# Altium project Board-PCB.PrjPcb
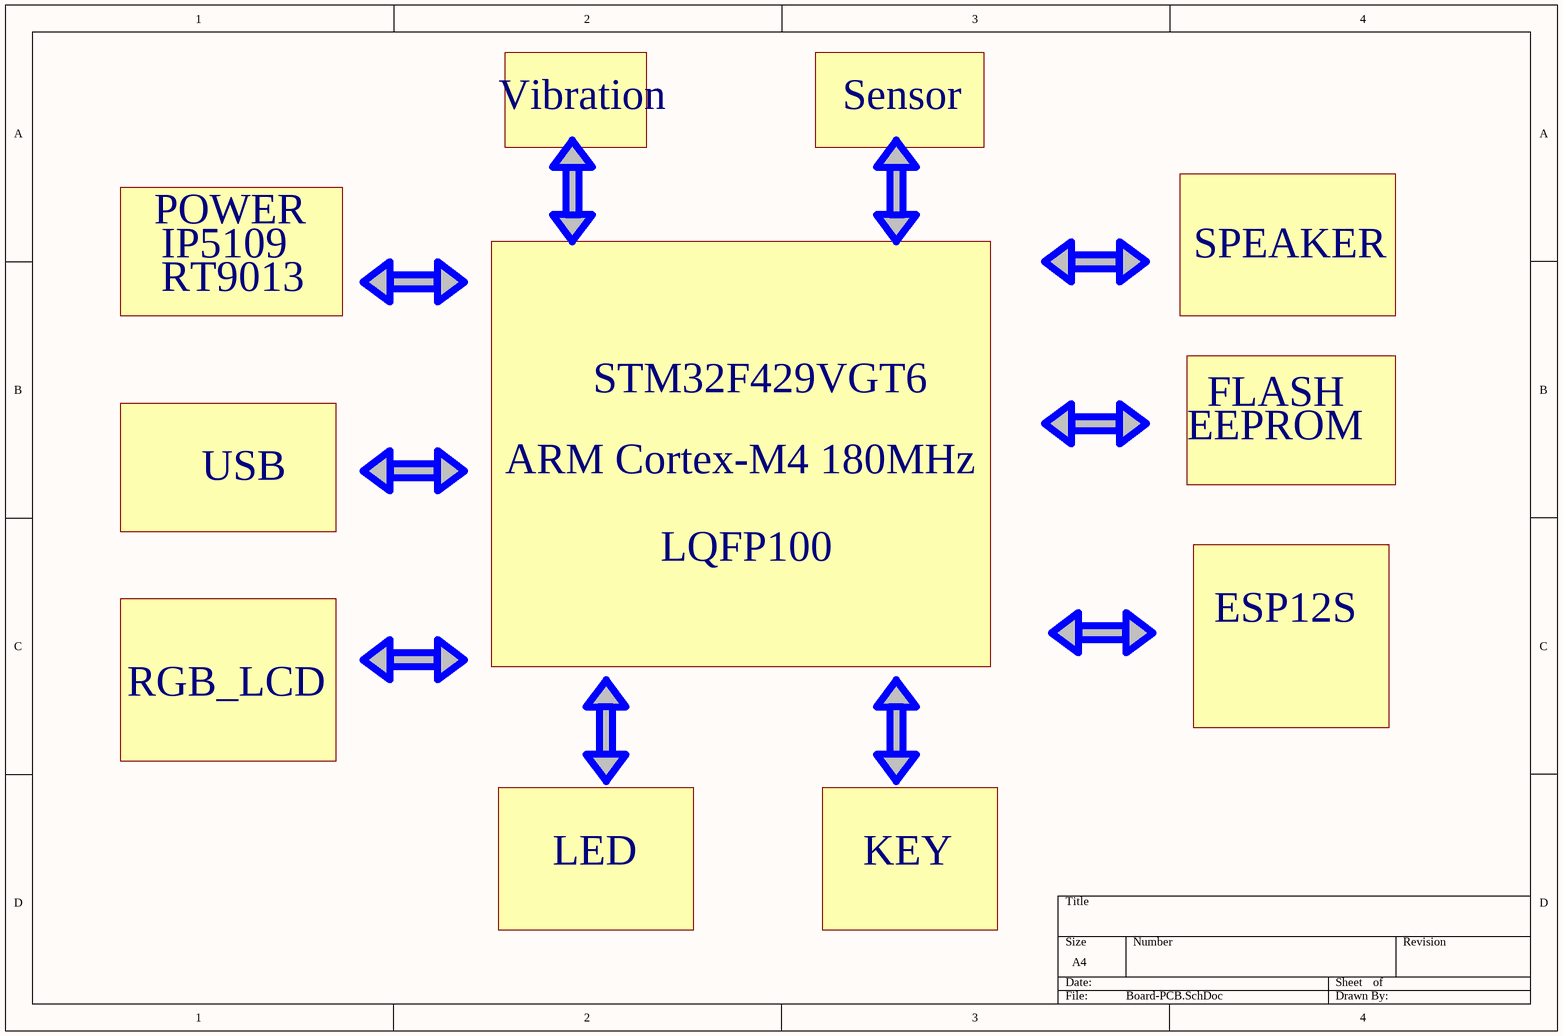
[diagram p0: Board-PCB.SchDoc]
10 sheets, 166 parts. Net scope: global (net labels, ports and power ports of the same name join across sheets).
Board files: Board-PCB.PcbDoc, PCB-Panel.PcbDoc
Sheets:
  Board-PCB.SchDoc
  MCU.SchDoc
  POWER.SchDoc
  USB.SchDoc
  memory.SchDoc
  LCD.SchDoc
  wireless.SchDoc
  sensor.SchDoc
  connect.SchDoc
  speaker.SchDoc

## Sheet Board-PCB.SchDoc: Bison-Board
size A4; DrawnBy: mzy2364; Revision: V1.4

### Notes on the sheet
- Vibration
- Sensor
- POWER
- IP5109
- RT9013
- SPEAKER
- STM32F429VGT6
- EEPROM
- FLASH
- USB
- ARM Cortex-M4 180MHz
- LQFP100
- ESP12S
- RGB_LCD
- LED
- KEY

## Sheet MCU.SchDoc: Bison-Board
size A2; DrawnBy: mzy2364; Revision: V1.4
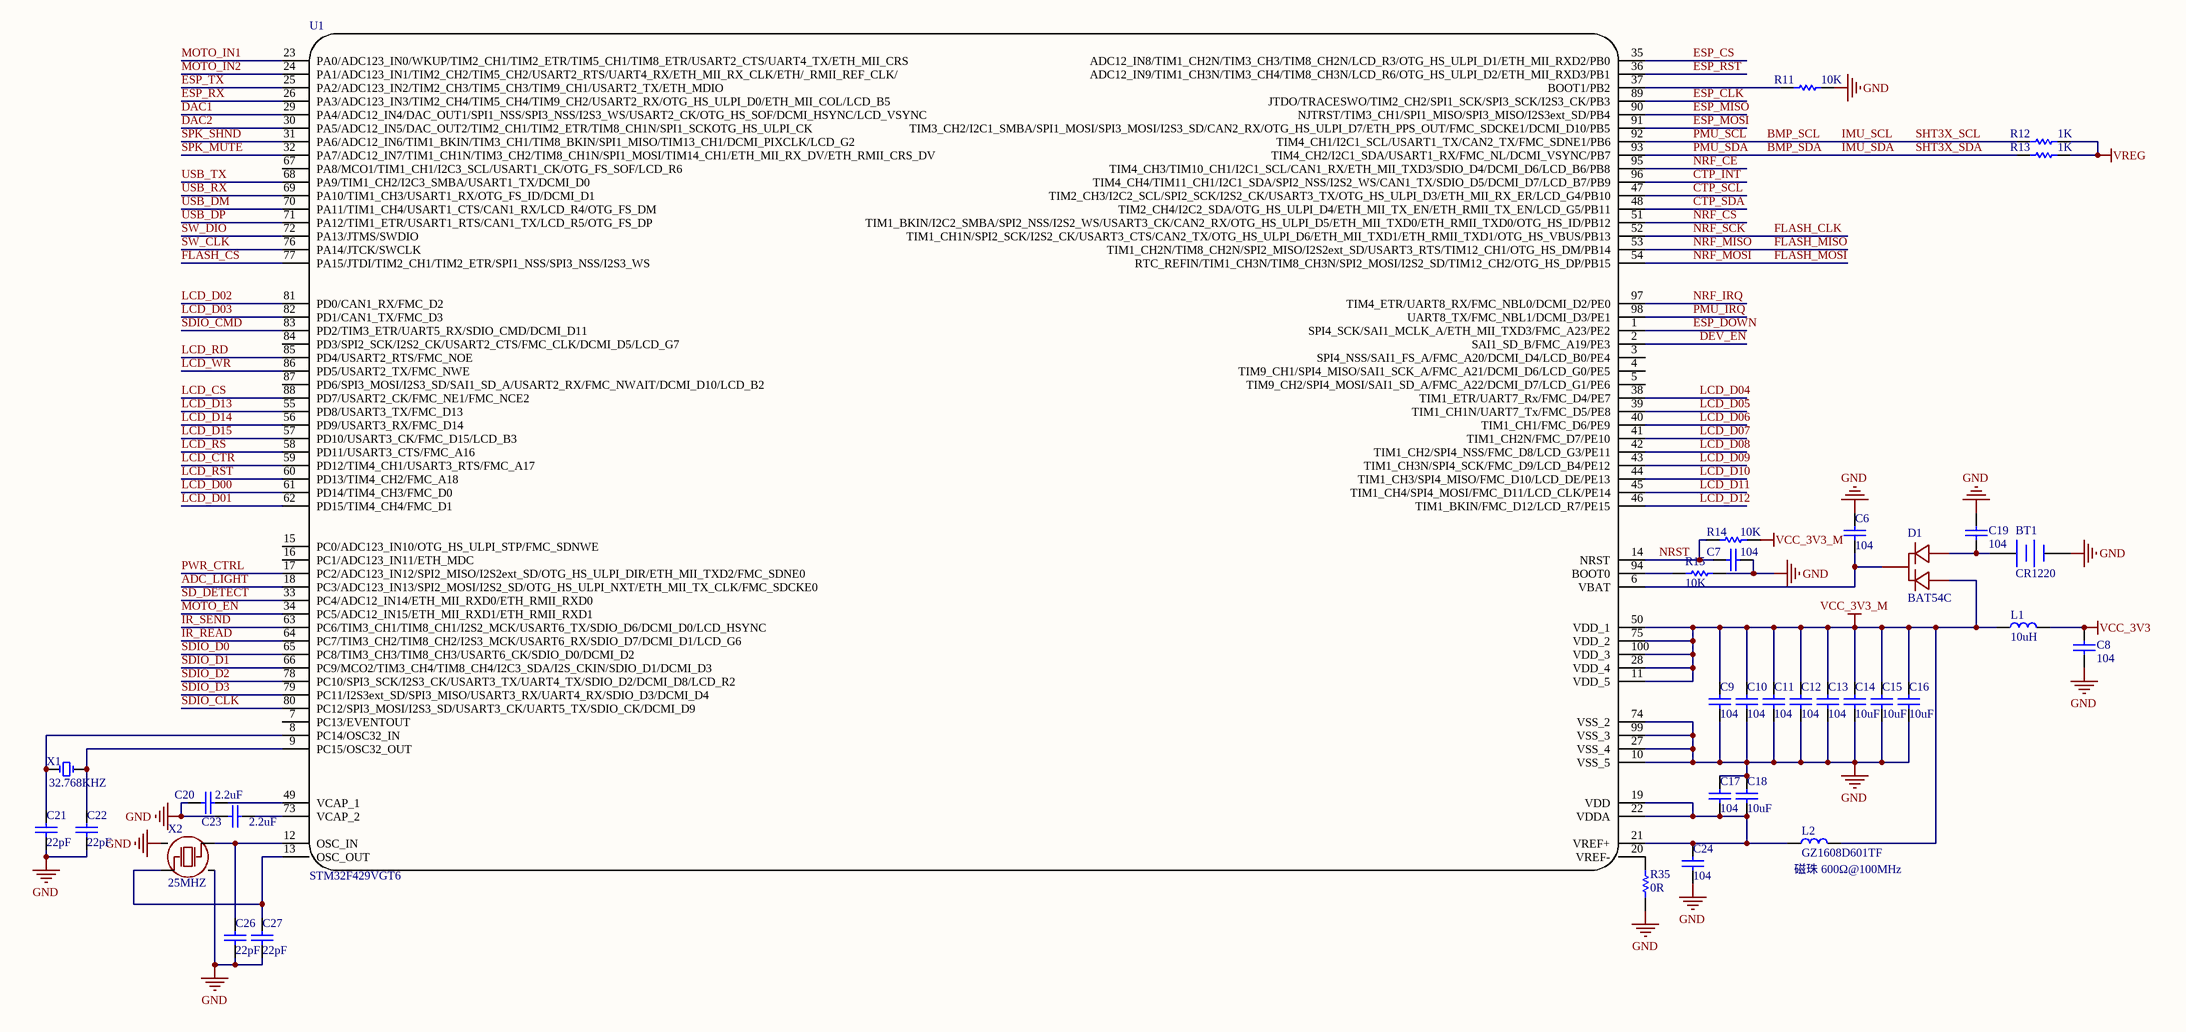
[diagram p1: MCU.SchDoc]

### Parts
BT1  CR1220  [CR1220-2]
C6  104  [C 0603]
C7  104  [C 0603]
C8  104  [C 0603]
C9  104  [C 0603]
C10  104  [C 0603]
C11  104  [C 0603]
C12  104  [C 0603]
C13  104  [C 0603]
C14  10uF  [C 0603]
C15  10uF  [C 0603]
C16  10uF  [C 0603]
C17  104  [C 0603]
C18  10uF  [C 0603]
C19  104  [C 0603]
C20  2.2uF  [C 0603]
C21  22pF  [C 0603]
C22  22pF  [C 0603]
C23  2.2uF  [C 0603]
C24  104  [C 0603]
C26  22pF  [C 0603]
C27  22pF  [C 0603]
D1  BAT54C  [SOT-23]
L1  10uH  [L 0603]
L2  GZ1608D601TF  [L 0603]
R11  10K  [R 0603]
R12  1K  [R 0603]
R13  1K  [R 0603]
R14  10K  [R 0603]
R15  10K  [R 0603]
R35  0R  [R 0603]
U1  STM32F429VGT6  [LQFP100]
X1  32.768KHZ  [XTAL-3215]
X2  25MHZ  [SMD-3225]

### Nets
GND: BT1.2(-) C6.2 C7.1 C8.1 C9.1 C10.1 C11.1 C12.1 C13.1 C14.1 C15.1 C16.1 C17.2 C18.2 C19.1 C20.1 C21.1 C22.1 C23.1 C24.1 C26.1 C27.1 R11.2 R15.2 R35.1 U1.10(VSS_5) U1.27(VSS_4) U1.74(VSS_2) U1.99(VSS_3) X2.2 X2.4
VCC_3V3: C8.2 L1.2
VCC_3V3_M: C9.2 C10.2 C11.2 C12.2 C13.2 C14.2 C15.2 C16.2 D1.1(A) L1.1 L2.2 R14.1 U1.11(VDD_5) U1.28(VDD_4) U1.50(VDD_1) U1.75(VDD_2) U1.100(VDD_3)
VREG: R12.2 R13.2
ADC_LIGHT: U1.18(PC3/ADC123_IN13/SPI2_MOSI/I2S2_SD/OTG_HS_ULPI_NXT/ETH_MII_TX_CLK/FMC_SDCKE0)
BMP_SCL: R12.1 U1.92(TIM4_CH1/I2C1_SCL/USART1_TX/CAN2_TX/FMC_SDNE1/PB6)  [also labelled IMU_SCL, PMU_SCL, SHT3X_SCL]
BMP_SDA: R13.1 U1.93(TIM4_CH2/I2C1_SDA/USART1_RX/FMC_NL/DCMI_VSYNC/PB7)  [also labelled IMU_SDA, PMU_SDA, SHT3X_SDA]
CTP_INT: U1.96(TIM4_CH4/TIM11_CH1/I2C1_SDA/SPI2_NSS/I2S2_WS/CAN1_TX/SDIO_D5/DCMI_D7/LCD_B7/PB9)
CTP_SCL: U1.47(TIM2_CH3/I2C2_SCL/SPI2_SCK/I2S2_CK/USART3_TX/OTG_HS_ULPI_D3/ETH_MII_RX_ER/LCD_G4/PB10)
CTP_SDA: U1.48(TIM2_CH4/I2C2_SDA/OTG_HS_ULPI_D4/ETH_MII_TX_EN/ETH_RMII_TX_EN/LCD_G5/PB11)
DAC1: U1.29(PA4/ADC12_IN4/DAC_OUT1/SPI1_NSS/SPI3_NSS/I2S3_WS/USART2_CK/OTG_HS_SOF/DCMI_HSYNC/LCD_VSYNC)
DAC2: U1.30(PA5/ADC12_IN5/DAC_OUT2/TIM2_CH1/TIM2_ETR/TIM8_CH1N/SPI1_SCKOTG_HS_ULPI_CK)
DEV_EN: U1.2(SAI1_SD_B/FMC_A19/PE3)
ESP_CLK: U1.89(JTDO/TRACESWO/TIM2_CH2/SPI1_SCK/SPI3_SCK/I2S3_CK/PB3)
ESP_CS: U1.35(ADC12_IN8/TIM1_CH2N/TIM3_CH3/TIM8_CH2N/LCD_R3/OTG_HS_ULPI_D1/ETH_MII_RXD2/PB0)
ESP_DOWN: U1.1(SPI4_SCK/SAI1_MCLK_A/ETH_MII_TXD3/FMC_A23/PE2)
ESP_MISO: U1.90(NJTRST/TIM3_CH1/SPI1_MISO/SPI3_MISO/I2S3ext_SD/PB4)
ESP_MOSI: U1.91(TIM3_CH2/I2C1_SMBA/SPI1_MOSI/SPI3_MOSI/I2S3_SD/CAN2_RX/OTG_HS_ULPI_D7/ETH_PPS_OUT/FMC_SDCKE1/DCMI_D10/PB5)
ESP_RST: U1.36(ADC12_IN9/TIM1_CH3N/TIM3_CH4/TIM8_CH3N/LCD_R6/OTG_HS_ULPI_D2/ETH_MII_RXD3/PB1)
ESP_RX: U1.26(PA3/ADC123_IN3/TIM2_CH4/TIM5_CH4/TIM9_CH2/USART2_RX/OTG_HS_ULPI_D0/ETH_MII_COL/LCD_B5)
ESP_TX: U1.25(PA2/ADC123_IN2/TIM2_CH3/TIM5_CH3/TIM9_CH1/USART2_TX/ETH_MDIO)
FLASH_CLK: U1.52(TIM1_CH1N/SPI2_SCK/I2S2_CK/USART3_CTS/CAN2_TX/OTG_HS_ULPI_D6/ETH_MII_TXD1/ETH_RMII_TXD1/OTG_HS_VBUS/PB13)  [also labelled NRF_SCK]
FLASH_CS: U1.77(PA15/JTDI/TIM2_CH1/TIM2_ETR/SPI1_NSS/SPI3_NSS/I2S3_WS)
FLASH_MISO: U1.53(TIM1_CH2N/TIM8_CH2N/SPI2_MISO/I2S2ext_SD/USART3_RTS/TIM12_CH1/OTG_HS_DM/PB14)  [also labelled NRF_MISO]
FLASH_MOSI: U1.54(RTC_REFIN/TIM1_CH3N/TIM8_CH3N/SPI2_MOSI/I2S2_SD/TIM12_CH2/OTG_HS_DP/PB15)  [also labelled NRF_MOSI]
IR_READ: U1.64(PC7/TIM3_CH2/TIM8_CH2/I2S3_MCK/USART6_RX/SDIO_D7/DCMI_D1/LCD_G6)
IR_SEND: U1.63(PC6/TIM3_CH1/TIM8_CH1/I2S2_MCK/USART6_TX/SDIO_D6/DCMI_D0/LCD_HSYNC)
LCD_CS: U1.88(PD7/USART2_CK/FMC_NE1/FMC_NCE2)
LCD_CTR: U1.59(PD12/TIM4_CH1/USART3_RTS/FMC_A17)
LCD_D00: U1.61(PD14/TIM4_CH3/FMC_D0)
LCD_D01: U1.62(PD15/TIM4_CH4/FMC_D1)
LCD_D02: U1.81(PD0/CAN1_RX/FMC_D2)
LCD_D03: U1.82(PD1/CAN1_TX/FMC_D3)
LCD_D04: U1.38(TIM1_ETR/UART7_Rx/FMC_D4/PE7)
LCD_D05: U1.39(TIM1_CH1N/UART7_Tx/FMC_D5/PE8)
LCD_D06: U1.40(TIM1_CH1/FMC_D6/PE9)
LCD_D07: U1.41(TIM1_CH2N/FMC_D7/PE10)
LCD_D08: U1.42(TIM1_CH2/SPI4_NSS/FMC_D8/LCD_G3/PE11)
LCD_D09: U1.43(TIM1_CH3N/SPI4_SCK/FMC_D9/LCD_B4/PE12)
LCD_D10: U1.44(TIM1_CH3/SPI4_MISO/FMC_D10/LCD_DE/PE13)
LCD_D11: U1.45(TIM1_CH4/SPI4_MOSI/FMC_D11/LCD_CLK/PE14)
LCD_D12: U1.46(TIM1_BKIN/FMC_D12/LCD_R7/PE15)
LCD_D13: U1.55(PD8/USART3_TX/FMC_D13)
LCD_D14: U1.56(PD9/USART3_RX/FMC_D14)
LCD_D15: U1.57(PD10/USART3_CK/FMC_D15/LCD_B3)
LCD_RD: U1.85(PD4/USART2_RTS/FMC_NOE)
LCD_RS: U1.58(PD11/USART3_CTS/FMC_A16)
LCD_RST: U1.60(PD13/TIM4_CH2/FMC_A18)
LCD_WR: U1.86(PD5/USART2_TX/FMC_NWE)
MOTO_EN: U1.34(PC5/ADC12_IN15/ETH_MII_RXD1/ETH_RMII_RXD1)
MOTO_IN1: U1.23(PA0/ADC123_IN0/WKUP/TIM2_CH1/TIM2_ETR/TIM5_CH1/TIM8_ETR/USART2_CTS/UART4_TX/ETH_MII_CRS)
MOTO_IN2: U1.24(PA1/ADC123_IN1/TIM2_CH2/TIM5_CH2/USART2_RTS/UART4_RX/ETH_MII_RX_CLK/ETH/_RMII_REF_CLK/)
NRF_CE: U1.95(TIM4_CH3/TIM10_CH1/I2C1_SCL/CAN1_RX/ETH_MII_TXD3/SDIO_D4/DCMI_D6/LCD_B6/PB8)
NRF_CS: U1.51(TIM1_BKIN/I2C2_SMBA/SPI2_NSS/I2S2_WS/USART3_CK/CAN2_RX/OTG_HS_ULPI_D5/ETH_MII_TXD0/ETH_RMII_TXD0/OTG_HS_ID/PB12)
NRF_IRQ: U1.97(TIM4_ETR/UART8_RX/FMC_NBL0/DCMI_D2/PE0)
NRST: C7.2 R14.2 U1.14(NRST)
PMU_IRQ: U1.98(UART8_TX/FMC_NBL1/DCMI_D3/PE1)
PWR_CTRL: U1.17(PC2/ADC123_IN12/SPI2_MISO/I2S2ext_SD/OTG_HS_ULPI_DIR/ETH_MII_TXD2/FMC_SDNE0)
SD_DETECT: U1.33(PC4/ADC12_IN14/ETH_MII_RXD0/ETH_RMII_RXD0)
SDIO_CLK: U1.80(PC12/SPI3_MOSI/I2S3_SD/USART3_CK/UART5_TX/SDIO_CK/DCMI_D9)
SDIO_CMD: U1.83(PD2/TIM3_ETR/UART5_RX/SDIO_CMD/DCMI_D11)
SDIO_D0: U1.65(PC8/TIM3_CH3/TIM8_CH3/USART6_CK/SDIO_D0/DCMI_D2)
SDIO_D1: U1.66(PC9/MCO2/TIM3_CH4/TIM8_CH4/I2C3_SDA/I2S_CKIN/SDIO_D1/DCMI_D3)
SDIO_D2: U1.78(PC10/SPI3_SCK/I2S3_CK/USART3_TX/UART4_TX/SDIO_D2/DCMI_D8/LCD_R2)
SDIO_D3: U1.79(PC11/I2S3ext_SD/SPI3_MISO/USART3_RX/UART4_RX/SDIO_D3/DCMI_D4)
SPK_MUTE: U1.32(PA7/ADC12_IN7/TIM1_CH1N/TIM3_CH2/TIM8_CH1N/SPI1_MOSI/TIM14_CH1/ETH_MII_RX_DV/ETH_RMII_CRS_DV)
SPK_SHND: U1.31(PA6/ADC12_IN6/TIM1_BKIN/TIM3_CH1/TIM8_BKIN/SPI1_MISO/TIM13_CH1/DCMI_PIXCLK/LCD_G2)
SW_CLK: U1.76(PA14/JTCK/SWCLK)
SW_DIO: U1.72(PA13/JTMS/SWDIO)
USB_DM: U1.70(PA11/TIM1_CH4/USART1_CTS/CAN1_RX/LCD_R4/OTG_FS_DM)
USB_DP: U1.71(PA12/TIM1_ETR/USART1_RTS/CAN1_TX/LCD_R5/OTG_FS_DP)
USB_RX: U1.69(PA10/TIM1_CH3/USART1_RX/OTG_FS_ID/DCMI_D1)
USB_TX: U1.68(PA9/TIM1_CH2/I2C3_SMBA/USART1_TX/DCMI_D0)
NetBT1_1: BT1.1(+) C19.2 D1.2(A)
NetC6_1: C6.1 D1.3(C) U1.6(VBAT)
NetC17_1: C17.1 C18.1 C24.2 L2.1 U1.19(VDD) U1.21(VREF+) U1.22(VDDA)
NetC20_2: C20.2 U1.49(VCAP_1)
NetC21_2: C21.2 U1.8(PC14/OSC32_IN) X1.1
NetC22_2: C22.2 U1.9(PC15/OSC32_OUT) X1.2
NetC23_2: C23.2 U1.73(VCAP_2)
NetC26_2: C26.2 U1.12(OSC_IN) X2.3
NetC27_2: C27.2 U1.13(OSC_OUT) X2.1
NetR11_1: R11.1 U1.37(BOOT1/PB2)
NetR15_1: R15.1 U1.94(BOOT0)
NetR35_2: R35.2 U1.20(VREF-)

Not connected (* = marked no-connect by the designer): U1 3(SPI4_NSS/SAI1_FS_A/FMC_A20/DCMI_D4/LCD_B0/PE4) 4(TIM9_CH1/SPI4_MISO/SAI1_SCK_A/FMC_A21/DCMI_D6/LCD_G0/PE5) 5(TIM9_CH2/SPI4_MOSI/SAI1_SD_A/FMC_A22/DCMI_D7/LCD_G1/PE6) 7(PC13/EVENTOUT) 15(PC0/ADC123_IN10/OTG_HS_ULPI_STP/FMC_SDNWE) 16(PC1/ADC123_IN11/ETH_MDC) 67(PA8/MCO1/TIM1_CH1/I2C3_SCL/USART1_CK/OTG_FS_SOF/LCD_R6) 84(PD3/SPI2_SCK/I2S2_CK/USART2_CTS/FMC_CLK/DCMI_D5/LCD_G7) 87(PD6/SPI3_MOSI/I2S3_SD/SAI1_SD_A/USART2_RX/FMC_NWAIT/DCMI_D10/LCD_B2)

### Notes on the sheet
- (near L2) 磁珠 600Ω@100MHz

### Library data of the parts
BT1 = Battery: Multicell Battery; Published: 24-Mar-1999; LatestRevisionDate: 17-Jul-2002; LatestRevisionNote: Re-released for DXP Platform.; PackageReference: BAT-2; Publisher: Altium Limited; PackageDescription: Battery; 2 Leads
C6-C24 C26 C27 = CAP
L1 L2 = INDUCTOR
R11-R15 R35 = RES
X1 = XTAL-2P
X2 = XTAL-4P

## Sheet POWER.SchDoc: Bison-Board
size A4; DrawnBy: mzy2364; Revision: V1.4
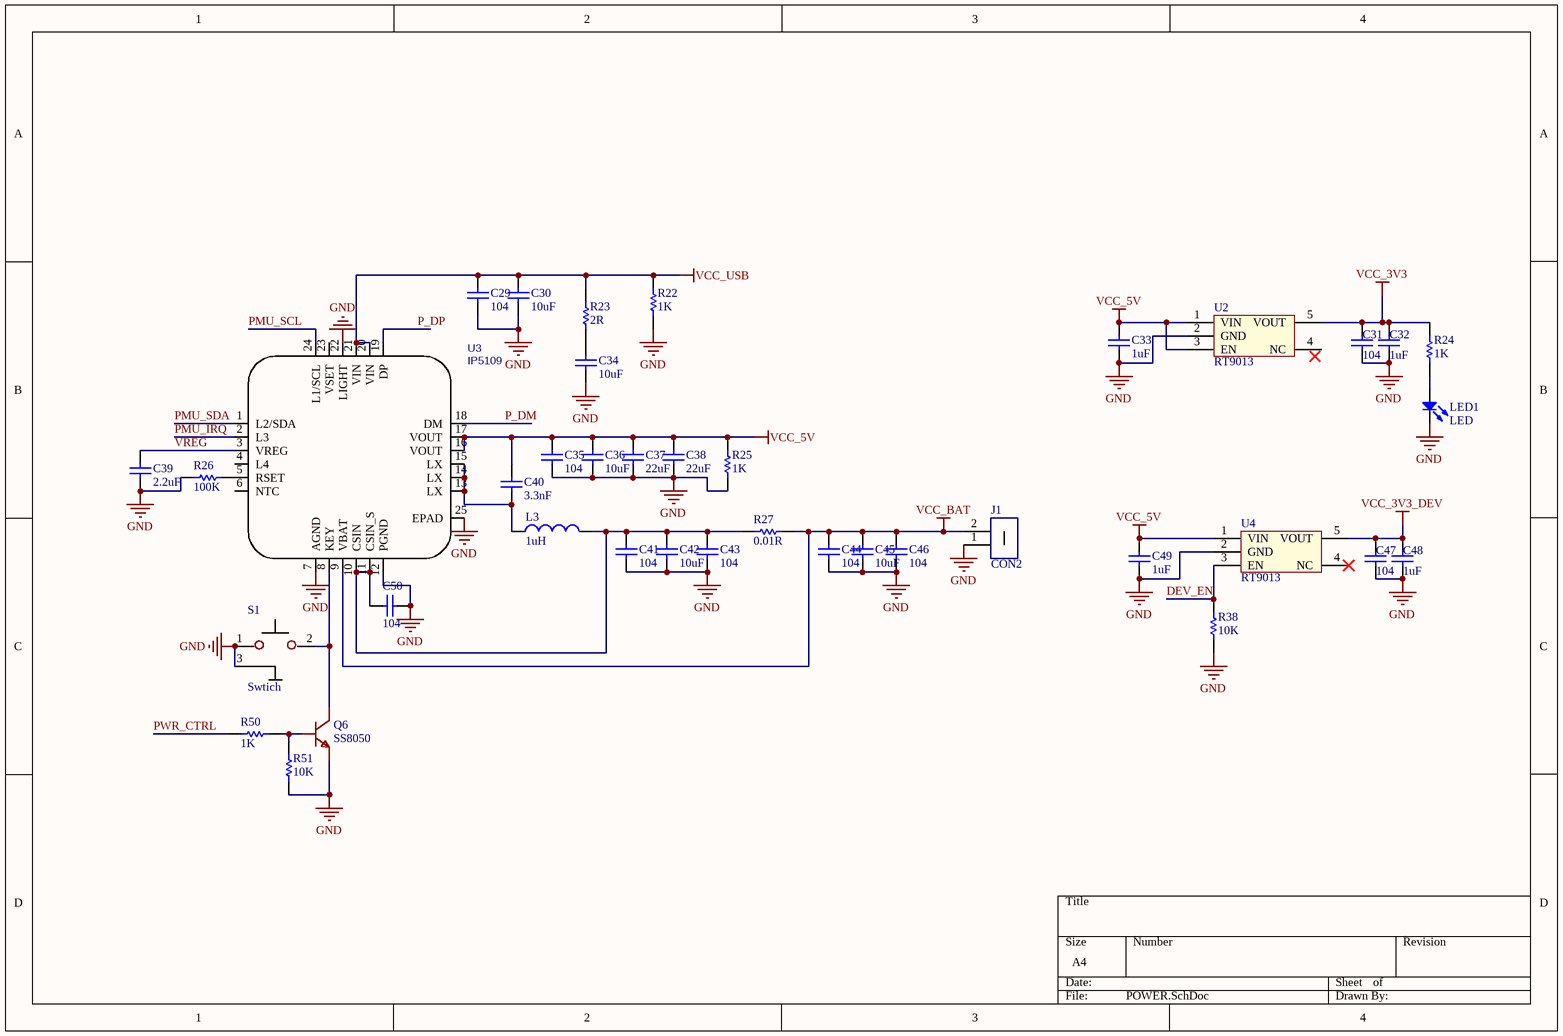
[diagram p2: POWER.SchDoc]

### Parts
C29  104  [C 0603]
C30  10uF  [C 0603]
C31  104  [C 0603]
C32  1uF  [C 0603]
C33  1uF  [C 0603]
C34  10uF  [C 0603]
C35  104  [C 0603]
C36  10uF  [C 0603]
C37  22uF  [C 0603]
C38  22uF  [C 0603]
C39  2.2uF  [C 0603]
C40  3.3nF  [C 0603]
C41  104  [C 0603]
C42  10uF  [C 0603]
C43  104  [C 0603]
C44  104  [C 0603]
C45  10uF  [C 0603]
C46  104  [C 0603]
C47  104  [C 0603]
C48  1uF  [C 0603]
C49  1uF  [C 0603]
C50  104  [C 0603]
J1  CON2  [XH-2P-SMD]
L3  1uH  [L_7*7]
LED1  LED  [0603_LED]
Q6  SS8050  [SOT-23]
R22  1K  [R 0603]
R23  2R  [R 0603]
R24  1K  [R 0603]
R25  1K  [R 0603]
R26  100K  [R 0603]
R27  0.01R  [R 1206]
R38  10K  [R 0603]
R50  1K  [R 0603]
R51  10K  [R 0603]
S1  Swtich  [SW3*6]
U2  RT9013  [SOT23-5]
U3  IP5109  [QFN-24]
U4  RT9013  [SOT23-5]

### Nets
GND: C29.1 C30.1 C31.1 C32.1 C33.1 C34.1 C35.1 C36.1 C37.1 C38.1 C39.1 C41.1 C42.1 C43.1 C44.1 C45.1 C46.1 C47.1 C48.1 C49.1 C50.1 J1.1 LED1.2(K) Q6.2(E) R22.1 R25.1 R26.2 R38.1 R51.1 S1.1 S1.3 U2.2(GND) U3.7(AGND) U3.12(PGND) U3.22(LIGHT) U3.25(EPAD) U4.2(GND)
VCC_3V3: C31.2 C32.2 R24.2 U2.5(VOUT)
VCC_3V3_DEV: C47.2 C48.2 U4.5(VOUT)
VCC_5V: C33.2 C35.2 C36.2 C37.2 C38.2 C40.2 C49.2 R25.2 U2.1(VIN) U2.3(EN) U3.16(VOUT) U3.17(VOUT) U4.1(VIN)
VCC_BAT: C44.2 C45.2 C46.2 J1.2 R27.1 U3.9(VBAT)
VCC_USB: C29.2 C30.2 R22.2 R23.2 U3.20(VIN) U3.21(VIN)
VREG: C39.2 U3.3(VREG)
DEV_EN: R38.2 U4.3(EN)
P_DM: U3.18(DM)
P_DP: U3.19(DP)
PMU_IRQ: U3.2(L3)
PMU_SCL: U3.24(L1/SCL)  [project net BMP_SCL]
PMU_SDA: U3.1(L2/SDA)  [project net BMP_SDA]
PWR_CTRL: R50.2
NetC34_2: C34.2 R23.1
NetC40_1: C40.1 L3.1 U3.13(LX) U3.14(LX) U3.15(LX)
NetC41_2: C41.2 C42.2 C43.2 C50.2 L3.2 R27.2 U3.10(CSIN) U3.11(CSIN_S)
NetLED1_1: LED1.1(A) R24.1
NetQ6_1: Q6.1(B) R50.1 R51.2
NetQ6_3: Q6.3(C) S1.2 U3.8(KEY)
NetR26_1: R26.1 U3.5(RSET)

Not connected (* = marked no-connect by the designer): U2 4(NC); U3 4(L4) 6(NTC) 23(VSET); U4 4(NC)*

### Library data of the parts
C29 C30 C34-C38 C40-C46 C50 = Cap: Capacitor
C31-C33 C39 C47-C49 = CAP
L3 = Inductor
Q6 = NPN
R22-R27 R38 R50 R51 = RES
S1 = Switch-th
U2 U4 = RT9013: 500mA低压差LDO
U3 = IP5109: BOM_Manufacturer: INJOINIC; Contributor: LCSC; SMT Type: Extend; BOM_Supplier: LCSC; BOM_Supplier Part: C181699; BOM_Manufacturer Part: IP5109; BOM_LCSC Assembly: Yes; spicePre: U; spiceSymbolName: IP5109

## Sheet USB.SchDoc: Bison-Board
size A4; DrawnBy: mzy2364; Revision: V1.4
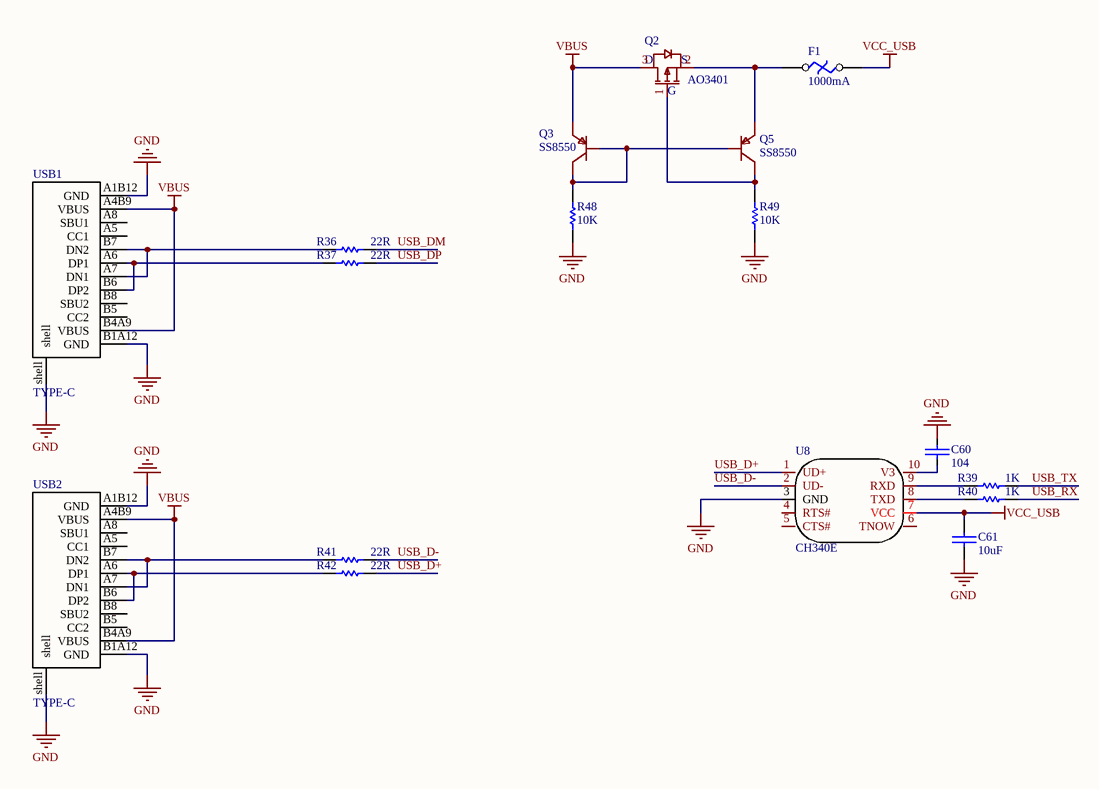
[diagram p3: USB.SchDoc]

### Parts
C60  104  [C 0603]
C61  10uF  [C 0603]
F1  1000mA  [F 0805]
Q2  AO3401  [SOT-23]
Q3  SS8550  [SOT-23]
Q5  SS8550  [SOT-23]
R36  22R  [R 0603]
R37  22R  [R 0603]
R39  1K  [R 0603]
R40  1K  [R 0603]
R41  22R  [R 0603]
R42  22R  [R 0603]
R48  10K  [R 0603]
R49  10K  [R 0603]
U8  CH340E  [MSOP-10]
USB1  TYPE-C  [USB-TYPE-C]
USB2  TYPE-C  [USB-TYPE-C]

### Nets
GND: C60.1 C61.2 R48.1 R49.1 U8.3(GND) USB1.A1B12(GND) USB1.B1A12(GND) USB1.shell USB2.A1B12(GND) USB2.B1A12(GND) USB2.shell
VBUS: Q2.3(D) Q3.2(E) USB1.A4B9(VBUS) USB1.B4A9(VBUS) USB2.A4B9(VBUS) USB2.B4A9(VBUS)
VCC_USB: C61.1 F1.2 U8.7(VCC)
USB_D+: R42.2 U8.1(UD+)
USB_D-: R41.2 U8.2(UD-)
USB_DM: R36.2
USB_DP: R37.2
USB_RX: R40.2
USB_TX: R39.2
NetC60_2: C60.2 U8.10(V3)
NetF1_1: F1.1 Q2.2(S) Q5.2(E)
NetQ2_1: Q2.1(G) Q5.3(C) R49.2
NetQ3_1: Q3.1(B) Q3.3(C) Q5.1(B) R48.2
NetR36_1: R36.1 USB1.A7(DN1) USB1.B7(DN2)
NetR37_1: R37.1 USB1.A6(DP1) USB1.B6(DP2)
NetR39_1: R39.1 U8.9(RXD)
NetR40_1: R40.1 U8.8(TXD)
NetR41_1: R41.1 USB2.A7(DN1) USB2.B7(DN2)
NetR42_1: R42.1 USB2.A6(DP1) USB2.B6(DP2)

Not connected (* = marked no-connect by the designer): U8 4(RTS#) 5(CTS#) 6(TNOW); USB1 A5(CC1) A8(SBU1) B5(CC2) B8(SBU2); USB2 A5(CC1) A8(SBU1) B5(CC2) B8(SBU2)

### Library data of the parts
C60 C61 = CAP: Capacitor
F1 = F: 熔断开关
Q2 = PMOS
Q3 Q5 = PNP
R36 R37 R39-R42 R48 R49 = RES
USB1 USB2 = USB TYPE-C: TYPE-C 16pin

## Sheet memory.SchDoc: Bison-Board
size A4; DrawnBy: mzy2364; Revision: V1.4
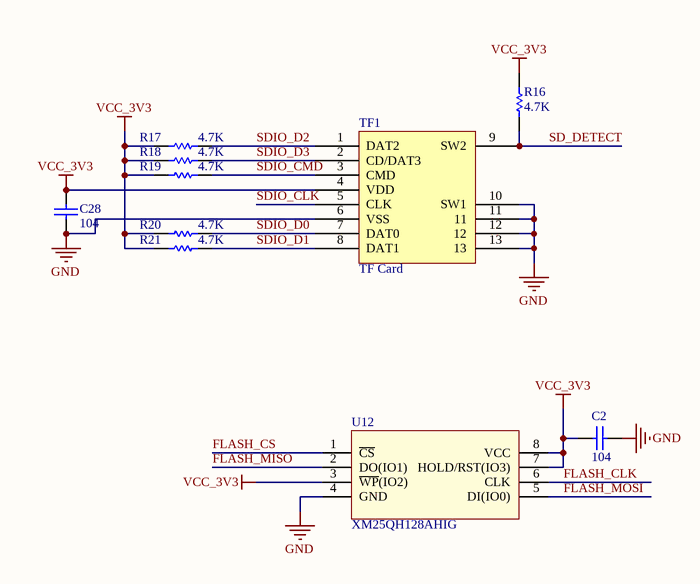
[diagram p4: memory.SchDoc]

### Parts
C2  104  [C 0603]
C28  104  [C 0603]
R16  4.7K  [R 0603]
R17  4.7K  [R 0603]
R18  4.7K  [R 0603]
R19  4.7K  [R 0603]
R20  4.7K  [R 0603]
R21  4.7K  [R 0603]
TF1  TF Card  [TF-Card]
U12  XM25QH128AHIG  [SOIC-8]

### Nets
GND: C2.2 C28.2 TF1.6(VSS) TF1.10(SW1) TF1.11 TF1.12 TF1.13 U12.4(GND)
VCC_3V3: C2.1 C28.1 R16.2 R17.1 R18.1 R19.1 R20.1 R21.1 TF1.4(VDD) U12.3(~{WP}(IO2)) U12.7(HOLD/RST(IO3)) U12.8(VCC)
FLASH_CLK: U12.6(CLK)
FLASH_CS: U12.1(~{CS})
FLASH_MISO: U12.2(DO(IO1))
FLASH_MOSI: U12.5(DI(IO0))
SD_DETECT: R16.1 TF1.9(SW2)
SDIO_CLK: TF1.5(CLK)
SDIO_CMD: R19.2 TF1.3(CMD)
SDIO_D0: R20.2 TF1.7(DAT0)
SDIO_D1: R21.2 TF1.8(DAT1)
SDIO_D2: R17.2 TF1.1(DAT2)
SDIO_D3: R18.2 TF1.2(CD/DAT3)

### Library data of the parts
C2 C28 = Cap: Capacitor
R16-R21 = RES
U12 = W25Q128

## Sheet LCD.SchDoc: Bison-Board
size A4; DrawnBy: mzy2364; Revision: V1.4
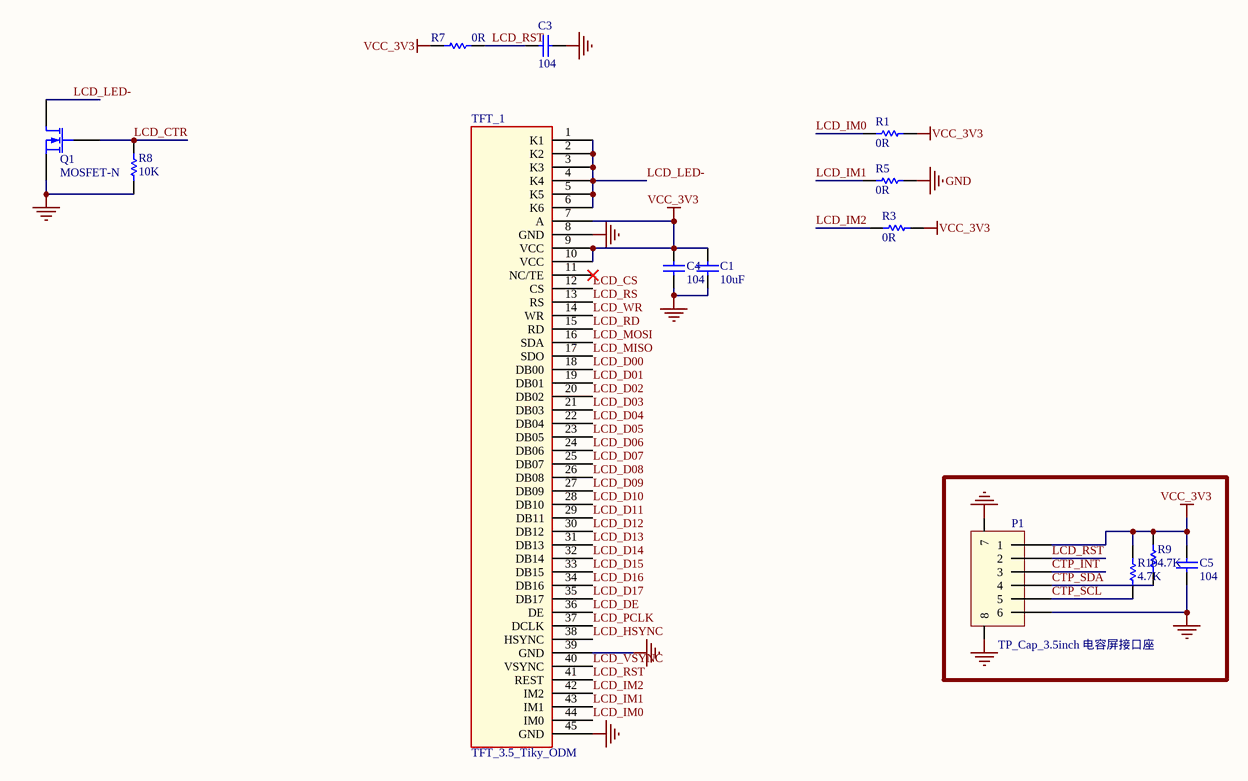
[diagram p5: LCD.SchDoc]

### Parts
C1  10uF  [C 0603]
C3  104  [C 0603]
C4  104  [C 0603]
C5  104  [C 0603]
P1  TP_Cap_3.5inch 电容屏接口座  [TP_Cap_3.5inch]
Q1  MOSFET-N  [SOT-23]
R1  0R  [R 0603]
R3  0R  [R 0603]
R5  0R  [R 0603]
R7  0R  [R 0603]
R8  10K  [R 0603]
R9  4.7K  [R 0603]
R10  4.7K  [R 0603]
TFT_1  TFT_3.5_Tiky_ODM  [TFT_3.5_TIKY_ODM]

### Nets
GND: C1.2 C3.1 C4.2 C5.2 P1.6 P1.7 P1.8 Q1.2(S) R5.2 R8.2 TFT_1.8(GND) TFT_1.39(GND) TFT_1.45(GND)
VCC_3V3: C1.1 C4.1 C5.1 P1.1 R1.2 R3.2 R7.1 R9.2 R10.2 TFT_1.7(A) TFT_1.9(VCC) TFT_1.10(VCC)
CTP_INT: P1.3
CTP_SCL: P1.5 R10.1
CTP_SDA: P1.4 R9.1
LCD_CS: TFT_1.12(CS)
LCD_CTR: Q1.1(G) R8.1
LCD_D00: TFT_1.18(DB00)
LCD_D01: TFT_1.19(DB01)
LCD_D02: TFT_1.20(DB02)
LCD_D03: TFT_1.21(DB03)
LCD_D04: TFT_1.22(DB04)
LCD_D05: TFT_1.23(DB05)
LCD_D06: TFT_1.24(DB06)
LCD_D07: TFT_1.25(DB07)
LCD_D08: TFT_1.26(DB08)
LCD_D09: TFT_1.27(DB09)
LCD_D10: TFT_1.28(DB10)
LCD_D11: TFT_1.29(DB11)
LCD_D12: TFT_1.30(DB12)
LCD_D13: TFT_1.31(DB13)
LCD_D14: TFT_1.32(DB14)
LCD_D15: TFT_1.33(DB15)
LCD_D16: TFT_1.34(DB16)
LCD_D17: TFT_1.35(DB17)
LCD_DE: TFT_1.36(DE)
LCD_HSYNC: TFT_1.38(HSYNC)
LCD_IM0: R1.1 TFT_1.44(IM0)
LCD_IM1: R5.1 TFT_1.43(IM1)
LCD_IM2: R3.1 TFT_1.42(IM2)
LCD_LED-: Q1.3(D) TFT_1.1(K1) TFT_1.2(K2) TFT_1.3(K3) TFT_1.4(K4) TFT_1.5(K5) TFT_1.6(K6)
LCD_MISO: TFT_1.17(SDO)
LCD_MOSI: TFT_1.16(SDA)
LCD_PCLK: TFT_1.37(DCLK)
LCD_RD: TFT_1.15(RD)
LCD_RS: TFT_1.13(RS)
LCD_RST: C3.2 P1.2 R7.2 TFT_1.41(REST)
LCD_VSYNC: TFT_1.40(VSYNC)
LCD_WR: TFT_1.14(WR)

Not connected (* = marked no-connect by the designer): TFT_1 11(NC/TE)*

### Library data of the parts
C1 C4 C5 = Cap: Capacitor
C3 = CAP
P1 = BHEADSMD1x6
R1 R3 R5 R7-R10 = RES

## Sheet wireless.SchDoc: Bison-Board
size A4; DrawnBy: mzy2364; Revision: V1.4
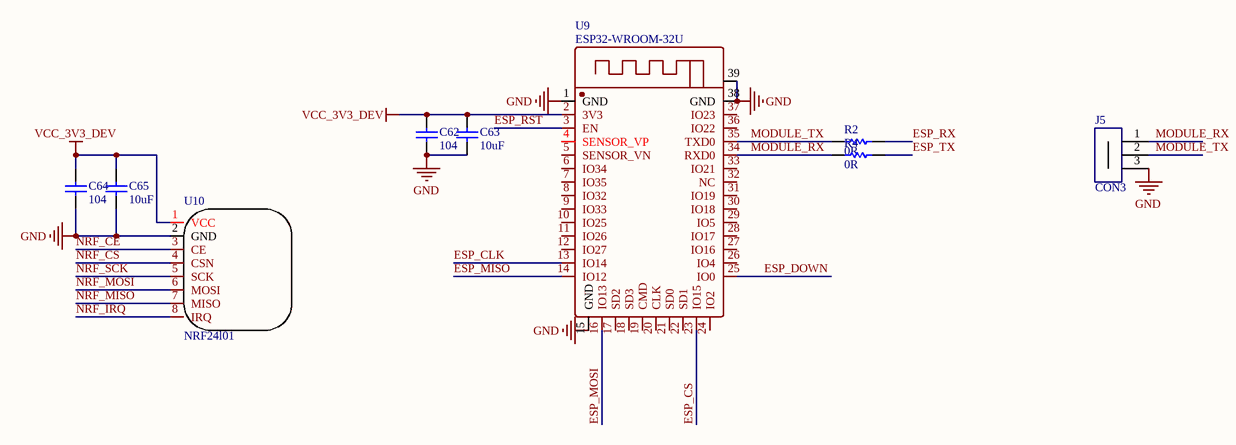
[diagram p6: wireless.SchDoc]

### Parts
C62  104  [C 0603]
C63  10uF  [C 0603]
C64  104  [C 0603]
C65  10uF  [C 0603]
J5  CON3  [SMD_3P-1.25]
R2  0R  [R 0603]
R4  0R  [R 0603]
U9  ESP32-WROOM-32U  [ESP32-WROOM-32U]
U10  NRF24l01  [NRF24l01]

### Nets
GND: C62.2 C63.2 C64.2 C65.2 J5.3 U9.1(GND) U9.15(GND) U9.38(GND) U9.39(GND) U10.2(GND)
VCC_3V3_DEV: C62.1 C63.1 C64.1 C65.1 U9.2(3V3) U10.1(VCC)
ESP_CLK: U9.13(IO14)
ESP_CS: U9.23(IO15)
ESP_DOWN: U9.25(IO0)
ESP_MISO: U9.14(IO12)
ESP_MOSI: U9.16(IO13)
ESP_RST: U9.3(EN)
ESP_RX: R2.2
ESP_TX: R4.2
MODULE_RX: J5.1 R4.1 U9.34(RXD0)
MODULE_TX: J5.2 R2.1 U9.35(TXD0)
NRF_CE: U10.3(CE)
NRF_CS: U10.4(CSN)
NRF_IRQ: U10.8(IRQ)
NRF_MISO: U10.7(MISO)  [project net FLASH_MISO]
NRF_MOSI: U10.6(MOSI)  [project net FLASH_MOSI]
NRF_SCK: U10.5(SCK)  [project net FLASH_CLK]

Not connected (* = marked no-connect by the designer): U9 4(SENSOR_VP) 5(SENSOR_VN) 6(IO34) 7(IO35) 8(IO32) 9(IO33) 10(IO25) 11(IO26) 12(IO27) 17(SD2) 18(SD3) 19(CMD) 20(CLK) 21(SD0) 22(SD1) 24(IO2) 26(IO4) 27(IO16) 28(IO17) 29(IO5) 30(IO18) 31(IO19) 32(NC) 33(IO21) 36(IO22) 37(IO23)

### Library data of the parts
C62-C65 = CAP
R2 R4 = RES

## Sheet sensor.SchDoc: Bison-Board
size A4; DrawnBy: mzy2364; Revision: V1.4
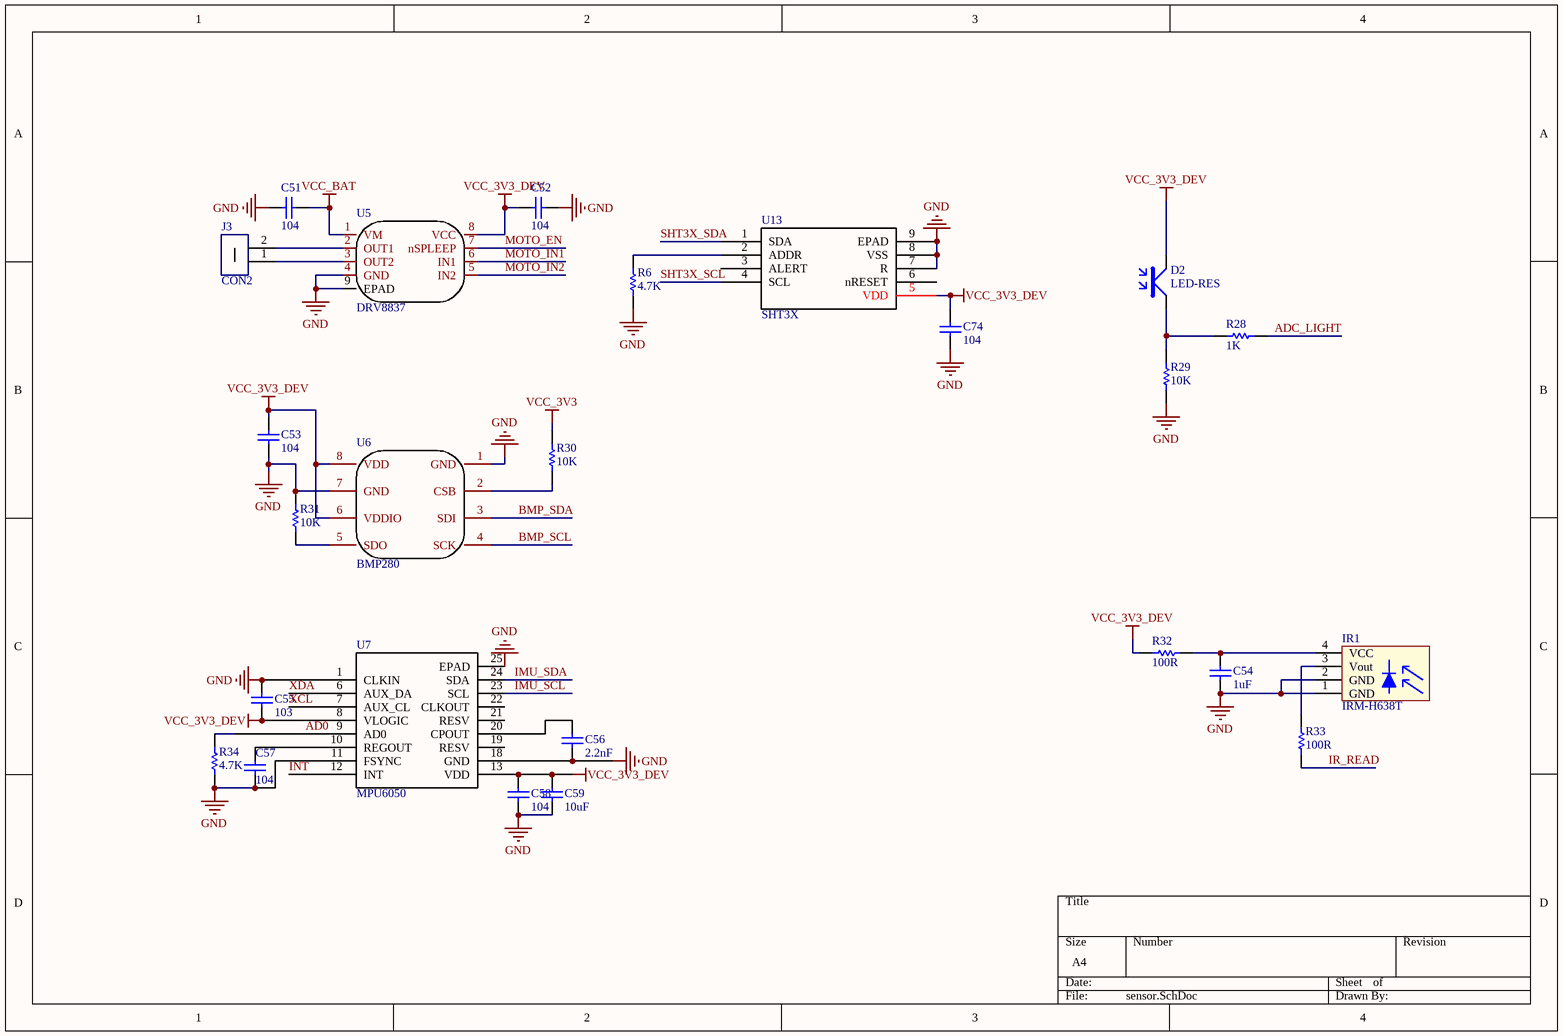
[diagram p7: sensor.SchDoc]

### Parts
C51  104  [C 0603]
C52  104  [C 0603]
C53  104  [C 0603]
C54  1uF  [C 0603]
C55  103  [C 0603]
C56  2.2nF  [C 0603]
C57  104  [C 0603]
C58  104  [C 0603]
C59  10uF  [C 0603]
C74  104  [C 0603]
D2  LED-RES  [LED 0805]
IR1  IRM-H638T  [IRM-H638T]
J3  CON2  [SMD_2P-1.25]
R6  4.7K  [R 0603]
R28  1K  [R 0603]
R29  10K  [R 0603]
R30  10K  [R 0603]
R31  10K  [R 0603]
R32  100R  [R 0603]
R33  100R  [R 0603]
R34  4.7K  [R 0603]
U5  DRV8837  [WSON-8]
U6  BMP280  [LGA-8]
U7  MPU6050  [QFN-24]
U13  SHT3X  [DFN-8]

### Nets
GND: C51.1 C52.2 C53.1 C54.2 C55.2 C56.2 C57.1 C58.1 C59.1 C74.2 IR1.1(GND) IR1.2(GND) R6.1 R29.1 R31.2 R34.1 U5.4(GND) U5.9(EPAD) U6.1(GND) U6.7(GND) U7.1(CLKIN) U7.11(FSYNC) U7.18(GND) U7.25(EPAD) U13.7(R) U13.8(VSS) U13.9(EPAD)
VCC_3V3: R30.2
VCC_3V3_DEV: C52.1 C53.2 C55.1 C58.2 C59.2 C74.1 D2.2 R32.1 U5.8(VCC) U6.6(VDDIO) U6.8(VDD) U7.8(VLOGIC) U7.13(VDD) U13.5(VDD)
VCC_BAT: C51.2 U5.1(VM)
AD0: R34.2 U7.9(AD0)
ADC_LIGHT: R28.2
BMP_SCL: U6.4(SCK) U7.23(SCL) U13.4(SCL)  [also labelled IMU_SCL, SHT3X_SCL]
BMP_SDA: U6.3(SDI) U7.24(SDA) U13.1(SDA)  [also labelled IMU_SDA, SHT3X_SDA]
INT: U7.12(INT)
IR_READ: R33.1
MOTO_EN: U5.7(nSPLEEP)
MOTO_IN1: U5.6(IN1)
MOTO_IN2: U5.5(IN2)
XCL: U7.7(AUX_CL)
XDA: U7.6(AUX_DA)
NetC54_1: C54.1 IR1.4(VCC) R32.2
NetC56_1: C56.1 U7.20(CPOUT)
NetC57_2: C57.2 U7.10(REGOUT)
NetD2_1: D2.1 R28.1 R29.2
NetIR1_3: IR1.3(Vout) R33.2
NetJ3_1: J3.1 U5.3(OUT2)
NetJ3_2: J3.2 U5.2(OUT1)
NetR6_2: R6.2 U13.2(ADDR)
NetR30_1: R30.1 U6.2(CSB)
NetR31_1: R31.1 U6.5(SDO)

Not connected (* = marked no-connect by the designer): U7 19(RESV) 21(RESV) 22(CLKOUT); U13 3(ALERT) 6(nRESET)

### Library data of the parts
C51-C54 C74 = CAP
C55-C59 = Cap: Capacitor; Published: *; LatestRevisionDate: *; LatestRevisionNote: *; PackageReference: *; Publisher: *
D2 = LRES: 光敏传感器
R6 R28-R34 = RES

## Sheet connect.SchDoc: Bison-Board
size A4; DrawnBy: mzy2364; Revision: V1.4
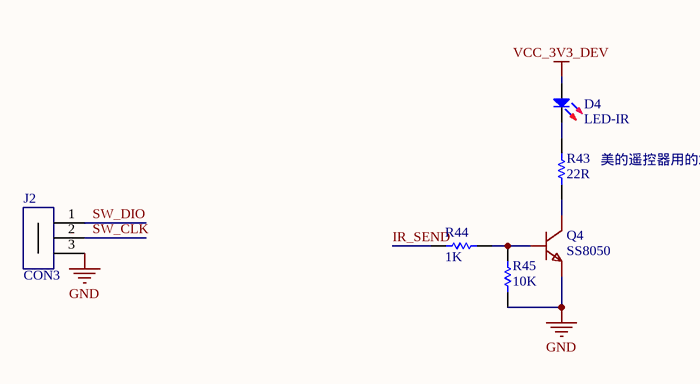
[diagram p8: connect.SchDoc]

### Parts
D4  LED-IR  [IR12-21C]
J2  CON3  [SMD_3P-1.25]
Q4  SS8050  [SOT-23]
R43  22R  [R 0603]
R44  1K  [R 0603]
R45  10K  [R 0603]

### Nets
GND: J2.3 Q4.2(E) R45.1
VCC_3V3_DEV: D4.1(A)
IR_SEND: R44.1
SW_CLK: J2.2
SW_DIO: J2.1
NetD4_2: D4.2(K) R43.2
NetQ4_1: Q4.1(B) R44.2 R45.2
NetQ4_3: Q4.3(C) R43.1

### Notes on the sheet
- 美的遥控器用的2R2

### Library data of the parts
Q4 = NPN
R43-R45 = RES

## Sheet speaker.SchDoc
size A4
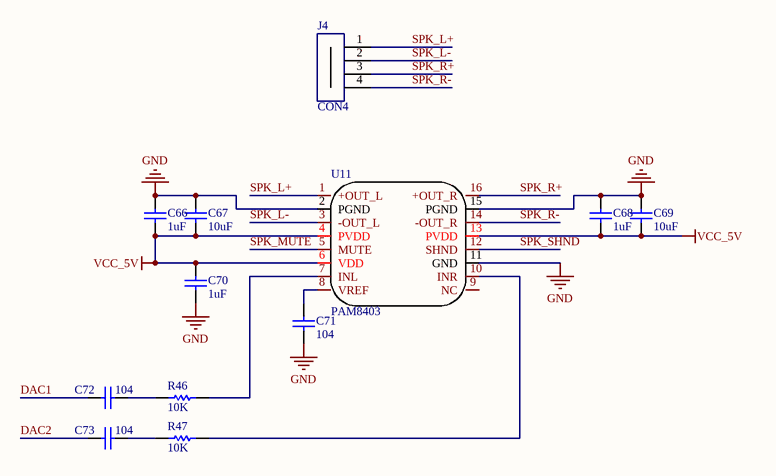
[diagram p9: speaker.SchDoc]

### Parts
C66  1uF  [C 0603]
C67  10uF  [C 0603]
C68  1uF  [C 0603]
C69  10uF  [C 0603]
C70  1uF  [C 0603]
C71  104  [C 0603]
C72  104  [C 0603]
C73  104  [C 0603]
J4  CON4  [SMD_4P-1.25]
R46  10K  [R 0603]
R47  10K  [R 0603]
U11  PAM8403  [SOP-16]

### Nets
GND: C66.2 C67.2 C68.2 C69.2 C70.1 C71.1 U11.2(PGND) U11.11(GND) U11.15(PGND)
VCC_5V: C66.1 C67.1 C68.1 C69.1 C70.2 U11.4(PVDD) U11.6(VDD) U11.13(PVDD)
DAC1: C72.2
DAC2: C73.2
SPK_L+: J4.1 U11.1(+OUT_L)
SPK_L-: J4.2 U11.3(-OUT_L)
SPK_MUTE: U11.5(MUTE)
SPK_R+: J4.3 U11.16(+OUT_R)
SPK_R-: J4.4 U11.14(-OUT_R)
SPK_SHND: U11.12(SHND)
NetC71_2: C71.2 U11.8(VREF)
NetC72_1: C72.1 R46.1
NetC73_1: C73.1 R47.1
NetR46_2: R46.2 U11.7(INL)
NetR47_2: R47.2 U11.10(INR)

Not connected (* = marked no-connect by the designer): U11 9(NC)

### Library data of the parts
C66-C73 = CAP
R46 R47 = RES

## Nets that join several sheets
GND: MCU (31 pins), POWER (37 pins), USB (11 pins), memory (8 pins), LCD (13 pins), wireless (10 pins), sensor (27 pins), connect (J2.3 Q4.2 R45.1), speaker (9 pins)
VCC_3V3: MCU (C8.2 L1.2), POWER (C31.2 C32.2 R24.2 U2.5), memory (12 pins), LCD (12 pins), sensor (R30.2)
VCC_3V3_DEV: POWER (C47.2 C48.2 U4.5), wireless (6 pins), sensor (14 pins), connect (D4.1)
VCC_5V: POWER (13 pins), speaker (8 pins)
VCC_BAT: POWER (6 pins), sensor (C51.2 U5.1)
VCC_USB: POWER (6 pins), USB (C61.1 F1.2 U8.7)
VREG: MCU (R12.2 R13.2), POWER (C39.2 U3.3)
ADC_LIGHT: MCU (U1.18), sensor (R28.2)
BMP_SCL: MCU (R12.1 U1.92), POWER (U3.24), sensor (U6.4 U7.23 U13.4)
BMP_SDA: MCU (R13.1 U1.93), POWER (U3.1), sensor (U6.3 U7.24 U13.1)
CTP_INT: MCU (U1.96), LCD (P1.3)
CTP_SCL: MCU (U1.47), LCD (P1.5 R10.1)
CTP_SDA: MCU (U1.48), LCD (P1.4 R9.1)
DAC1: MCU (U1.29), speaker (C72.2)
DAC2: MCU (U1.30), speaker (C73.2)
DEV_EN: MCU (U1.2), POWER (R38.2 U4.3)
ESP_CLK: MCU (U1.89), wireless (U9.13)
ESP_CS: MCU (U1.35), wireless (U9.23)
ESP_DOWN: MCU (U1.1), wireless (U9.25)
ESP_MISO: MCU (U1.90), wireless (U9.14)
ESP_MOSI: MCU (U1.91), wireless (U9.16)
ESP_RST: MCU (U1.36), wireless (U9.3)
ESP_RX: MCU (U1.26), wireless (R2.2)
ESP_TX: MCU (U1.25), wireless (R4.2)
FLASH_CLK: MCU (U1.52), memory (U12.6), wireless (U10.5)
FLASH_CS: MCU (U1.77), memory (U12.1)
FLASH_MISO: MCU (U1.53), memory (U12.2), wireless (U10.7)
FLASH_MOSI: MCU (U1.54), memory (U12.5), wireless (U10.6)
IR_READ: MCU (U1.64), sensor (R33.1)
IR_SEND: MCU (U1.63), connect (R44.1)
LCD_CS: MCU (U1.88), LCD (TFT_1.12)
LCD_CTR: MCU (U1.59), LCD (Q1.1 R8.1)
LCD_D00: MCU (U1.61), LCD (TFT_1.18)
LCD_D01: MCU (U1.62), LCD (TFT_1.19)
LCD_D02: MCU (U1.81), LCD (TFT_1.20)
LCD_D03: MCU (U1.82), LCD (TFT_1.21)
LCD_D04: MCU (U1.38), LCD (TFT_1.22)
LCD_D05: MCU (U1.39), LCD (TFT_1.23)
LCD_D06: MCU (U1.40), LCD (TFT_1.24)
LCD_D07: MCU (U1.41), LCD (TFT_1.25)
LCD_D08: MCU (U1.42), LCD (TFT_1.26)
LCD_D09: MCU (U1.43), LCD (TFT_1.27)
LCD_D10: MCU (U1.44), LCD (TFT_1.28)
LCD_D11: MCU (U1.45), LCD (TFT_1.29)
LCD_D12: MCU (U1.46), LCD (TFT_1.30)
LCD_D13: MCU (U1.55), LCD (TFT_1.31)
LCD_D14: MCU (U1.56), LCD (TFT_1.32)
LCD_D15: MCU (U1.57), LCD (TFT_1.33)
LCD_RD: MCU (U1.85), LCD (TFT_1.15)
LCD_RS: MCU (U1.58), LCD (TFT_1.13)
LCD_RST: MCU (U1.60), LCD (C3.2 P1.2 R7.2 TFT_1.41)
LCD_WR: MCU (U1.86), LCD (TFT_1.14)
MOTO_EN: MCU (U1.34), sensor (U5.7)
MOTO_IN1: MCU (U1.23), sensor (U5.6)
MOTO_IN2: MCU (U1.24), sensor (U5.5)
NRF_CE: MCU (U1.95), wireless (U10.3)
NRF_CS: MCU (U1.51), wireless (U10.4)
NRF_IRQ: MCU (U1.97), wireless (U10.8)
PMU_IRQ: MCU (U1.98), POWER (U3.2)
PWR_CTRL: MCU (U1.17), POWER (R50.2)
SD_DETECT: MCU (U1.33), memory (R16.1 TF1.9)
SDIO_CLK: MCU (U1.80), memory (TF1.5)
SDIO_CMD: MCU (U1.83), memory (R19.2 TF1.3)
SDIO_D0: MCU (U1.65), memory (R20.2 TF1.7)
SDIO_D1: MCU (U1.66), memory (R21.2 TF1.8)
SDIO_D2: MCU (U1.78), memory (R17.2 TF1.1)
SDIO_D3: MCU (U1.79), memory (R18.2 TF1.2)
SPK_MUTE: MCU (U1.32), speaker (U11.5)
SPK_SHND: MCU (U1.31), speaker (U11.12)
SW_CLK: MCU (U1.76), connect (J2.2)
SW_DIO: MCU (U1.72), connect (J2.1)
USB_DM: MCU (U1.70), USB (R36.2)
USB_DP: MCU (U1.71), USB (R37.2)
USB_RX: MCU (U1.69), USB (R40.2)
USB_TX: MCU (U1.68), USB (R39.2)